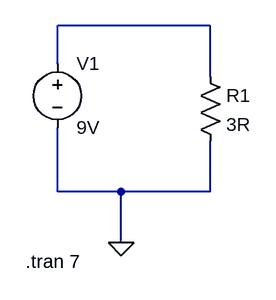
[diagram p0: schematic Draft1.asc]
Draft1.asc, the LTspice schematic file:
Version 4.1
SHEET 1 880 680
WIRE 384 0 192 0
WIRE 192 48 192 0
WIRE 384 64 384 0
WIRE 192 208 192 128
WIRE 272 208 192 208
WIRE 384 208 384 144
WIRE 384 208 272 208
WIRE 272 272 272 208
FLAG 272 272 0
SYMBOL voltage 192 32 R0
SYMATTR InstName V1
SYMATTR Value 9V
SYMBOL res 368 48 R0
SYMATTR InstName R1
SYMATTR Value 3R
TEXT 152 296 Left 2 !.tran 7

The netlist it stands for:
* Draft1.asc
V1 N001 0 9V
R1 N001 0 3R
.tran 7
.backanno
.end